# Altium schematic sheet Trans_V2.3.SchDoc
size A2
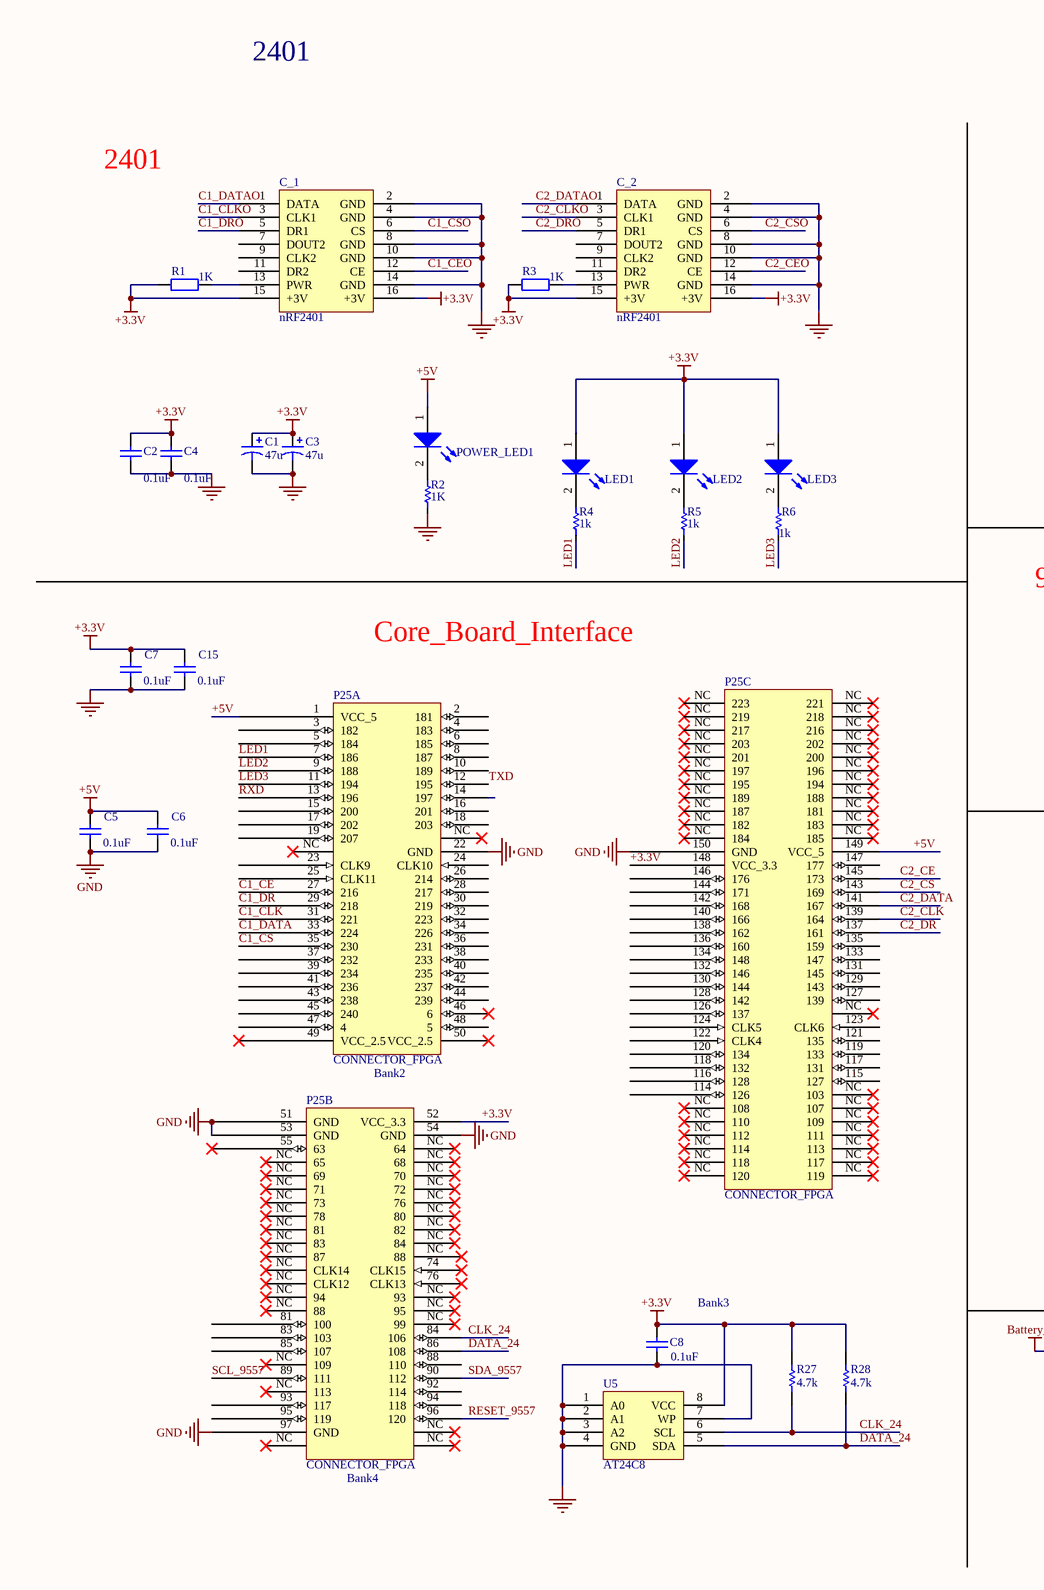
[diagram p0: Trans_V2.3.SchDoc, left]
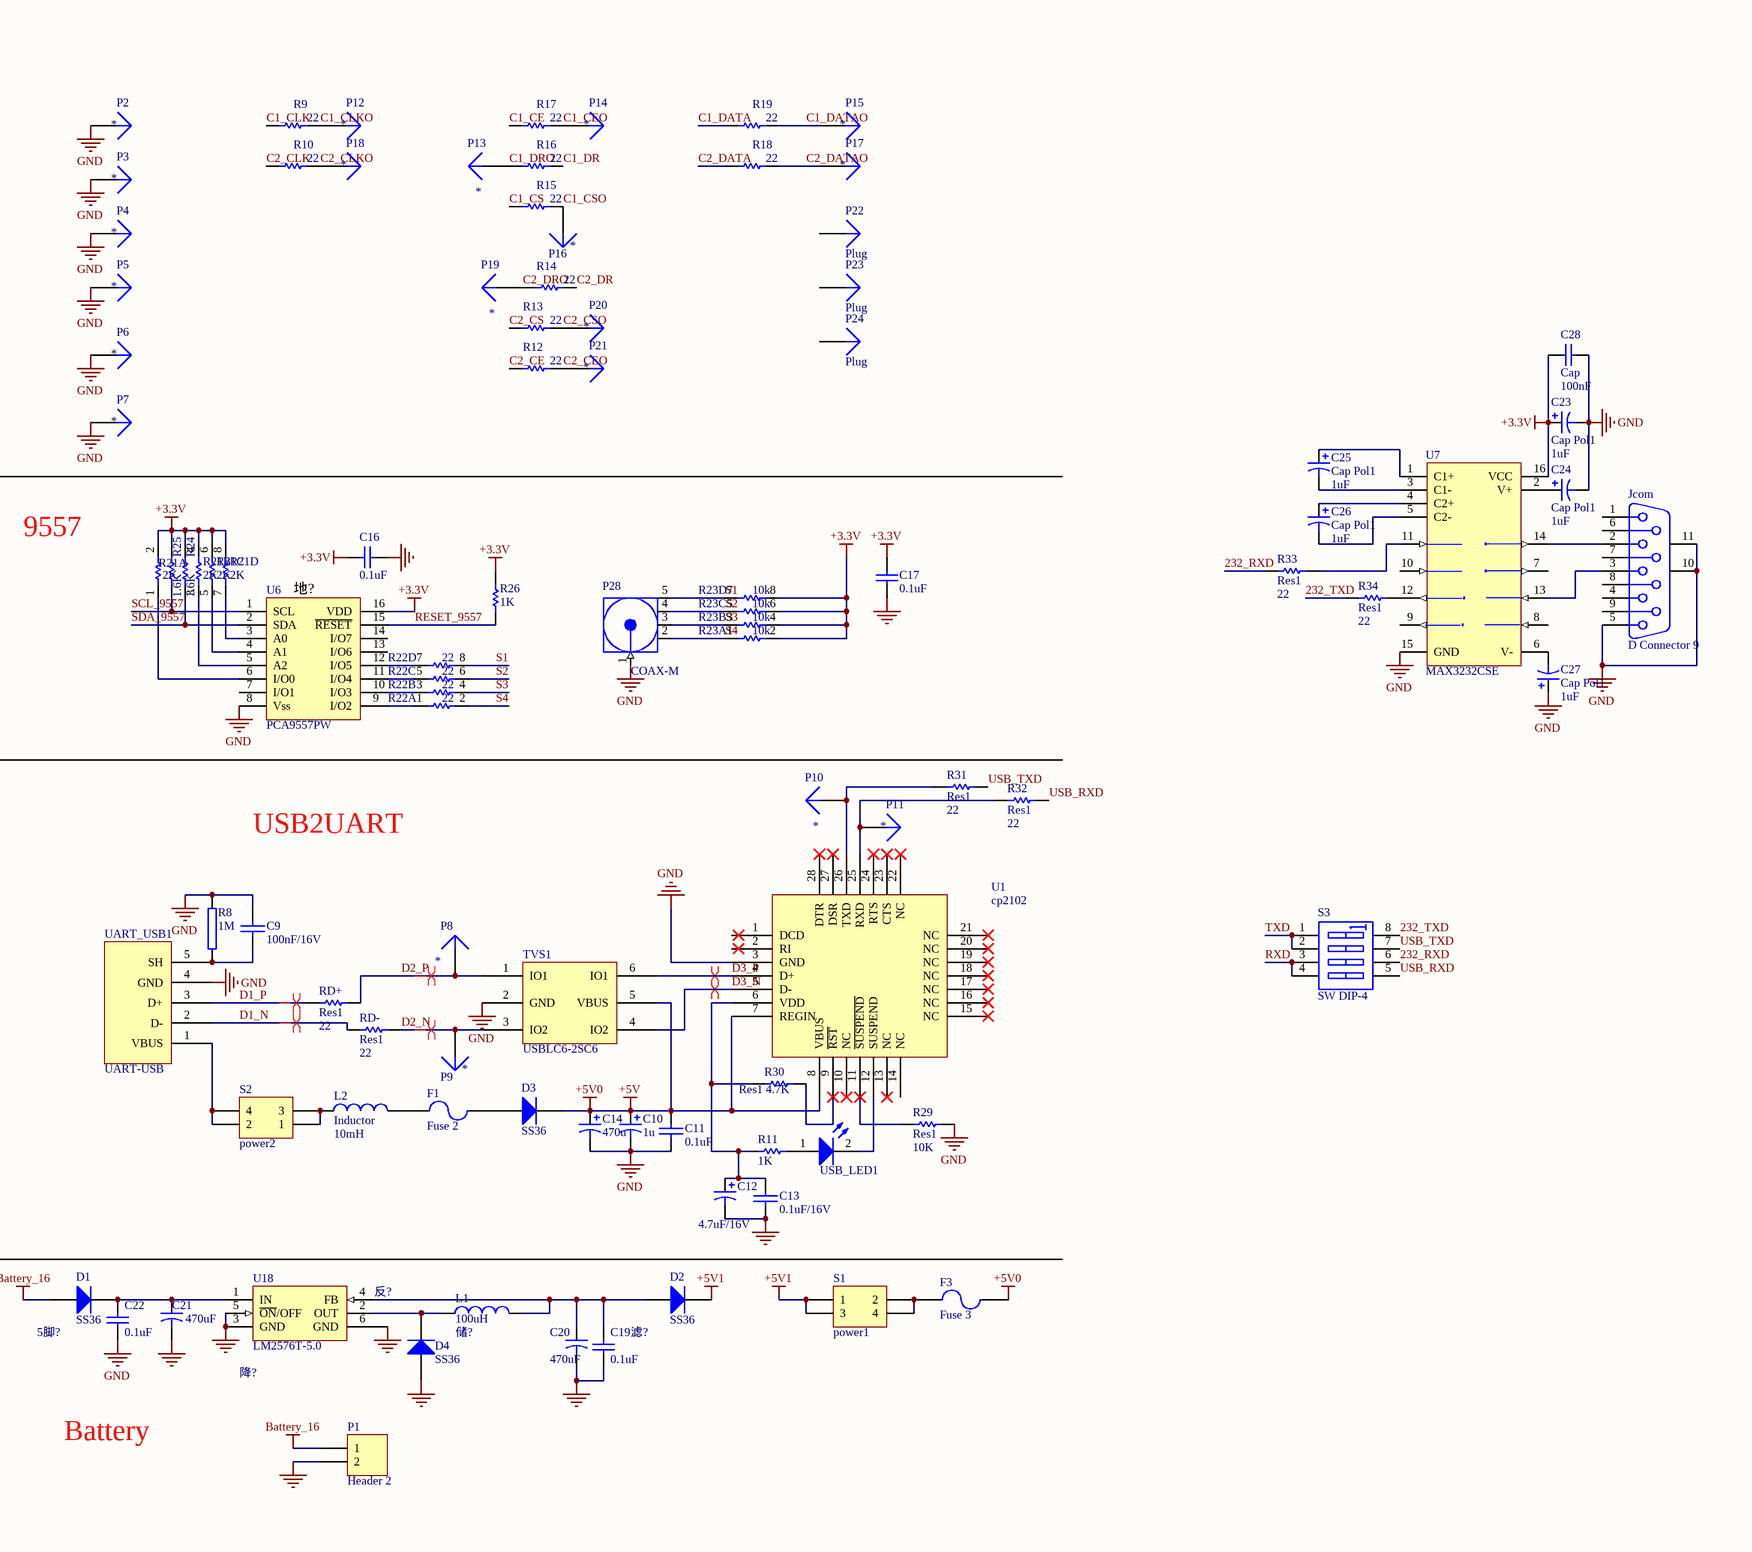
[diagram p1: Trans_V2.3.SchDoc, right]

## Parts
C1  47u  [7343c/d]
C2  0.1uF  [0805C]
C3  47u  [7343C/D]
C4  0.1uF  [0805C]
C5  0.1uF  [0805C]
C6  0.1uF  [0805C]
C7  0.1uF  [0805C]
C8  0.1uF  [0805C]
C9  100nF/16V  [0805C]
C10  1u  [CAP-3216]
C11  0.1uF  [0805C]
C12  4.7uF/16V  [CAP-3216]
C13  0.1uF/16V  [0805C]
C14  470u  [J10]
C15  0.1uF  [0805C]
C16  0.1uF  [0805C]
C17  0.1uF  [0805C]
C19  0.1uF  [0805C]
C20  470uF  [J10]
C21  470uF  [J10]
C22  0.1uF  [0805C]
C23  Cap Pol1  value 1uF  [CAP-3216]
C24  Cap Pol1  value 1uF  [CAP-3216]
C25  Cap Pol1  value 1uF  [CAP-3216]
C26  Cap Pol1  value 1uF  [CAP-3216]
C27  Cap Pol1  value 1uF  [CAP-3216]
C28  Cap  value 100nF  [0805C]
C_1  nRF2401  [HDR2X8]
C_2  nRF2401  [HDR2X8]
D1  SS36  [SMC]
D2  SS36  [SMC]
D3  SS36  [SMC]
D4  SS36  [SMC]
F1  Fuse 2  [保险丝1206]
F3  Fuse 3  [保险丝1206]
Jcom  D Connector 9  [DSUB1.385-2H9]
L1  value 100uH  [L]  (hidden comment: Inductor)
L2  Inductor  value 10mH  [1206]
LED1  LED1  [0805D]  (value not drawn)
LED2  LED2  [0805D]  (value not drawn)
LED3  LED3  [0805D]  (value not drawn)
P1  Header 2  [DC3]
P2  *  [安装孔-3.5-5]
P3  *  [安装孔-3.5-5]
P4  *  [安装孔-3.5-5]
P5  *  [安装孔-3.5-5]
P6  *  [安装孔-3.5-5]
P7  *  [安装孔-3.5-5]
P8  *  [TestPoint]
P9  *  [TestPoint]
P10  *  [TestPoint]
P11  *  [TestPoint]
P12  *  [TestPoint]
P13  *  [TestPoint]
P14  *  [TestPoint]
P15  *  [TestPoint]
P16  *  [TestPoint]
P17  *  [TestPoint]
P18  *  [TestPoint]
P19  *  [TestPoint]
P20  *  [TestPoint]
P21  *  [TestPoint]
P22  Plug  [MARK]
P23  Plug  [MARK]
P24  Plug  [MARK]
P25  CONNECTOR_FPGA  [CONNECTOR_FPGA]  (parts A,B,C of 3)
P28  COAX-M  [A6RV-161RS]
POWER_LED1  LED2  [0805D]  (value not drawn)
R1  1k  [0805R]
R2  1K  [0805R]
R3  1K  [0805R]
R4  1K  [0805R]
R5  1k  [0805R]
R6  1k  [0805R]
R8  1M  [0805R]
R9  22  [0805R]
R10  22  [0805R]
R11  1K  [0805R]
R12  22  [0805R]
R13  22  [0805R]
R14  22  [0805R]
R15  22  [0805R]
R16  22  [0805R]
R17  22  [0805R]
R18  22  [0805R]
R19  22  [0805R]
R21  2K  [0603排阻]  (parts A,B,C,D of 4)
R22  22  [0603排阻]  (parts A,B,C,D of 4)
R23  10k  [0603排阻]  (parts A,B,C,D of 4)
R24  1.6K  [0805R]
R25  1.6K  [0805R]
R26  1K  [0805R]
R27  value 4.7k  [0805R]  (hidden comment: 10k)
R28  value 4.7k  [0805R]  (hidden comment: 10k)
R29  Res1  value 10K  [0805R]
R30  Res1  value 4.7K  [0805R]
R31  Res1  value 22  [0805R]
R32  Res1  value 22  [0805R]
R33  Res1  value 22  [0805R]
R34  Res1  value 22  [0805R]
RD+  Res1  value 22  [0805R]
RD-  Res1  value 22  [0805R]
S1  power1  [A8L-21-11N2]
S2  power2  [A8L-21-11N2]
S3  SW DIP-4  [SO8_M]
TVS1  USBLC6-2SC6  [SOT23-6_M]
U1  cp2102  [QFN50P500X500-28VAM]
U5  AT24C8  [SO-G8]
U6  PCA9557PW  [TSSOP16]
U7  MAX3232CSE  [NSO16_M]
U18  LM2576T-5.0  [D2PAK]
UART_USB1  UART-USB  [USB-B]
USB_LED1  LED2  [0805D]  (value not drawn)

## Nets
+3.3V: C1.1 C2.2 C3.1 C4.2 C7.2 C8.2 C15.2 C16.2 C17.2 C23.1 C28.2 C_1.15(+3V) C_1.16(+3V) C_2.15(+3V) C_2.16(+3V) LED1.1(A) LED2.1(A) LED3.1(A) P25.52(VCC_3.3) P25.148(VCC_3.3) R1.1 R3.1 R21.2 R21.4 R21.6 R21.8 R23.2 R23.4 R23.6 R23.8 R24.1 R25.1 R26.2 R27.2 R28.2 U5.8(VCC) U6.16(VDD) U7.16(VCC)
+5V: C5.2 C6.2 C10.1 C11.1 C14.1 D3.2(K) F3.2 P25.1(VCC_5) P25.149(VCC_5) POWER_LED1.1(A) TVS1.5(VBUS) U1.7(REGIN) U1.8(VBUS)  [also labelled +5V0]
+5V1: D2.2(K) S1.1 S1.3
Battery_16: D1.1(A) P1.1
GND: C1.2 C2.1 C3.2 C4.1 C5.1 C6.1 C7.1 C8.1 C9.1 C10.2 C11.2 C12.2 C13.2 C14.2 C15.1 C16.1 C17.1 C19.1 C20.2 C21.2 C22.1 C23.2 C24.2 C27.1 C28.1 C_1.2(GND) C_1.4(GND) C_1.8(GND) C_1.10(GND) C_1.14(GND) C_2.2(GND) C_2.4(GND) C_2.8(GND) C_2.10(GND) C_2.14(GND) D4.1(A) Jcom.5 Jcom.10(MH1) Jcom.11(MH2) P1.2 P2.1 P3.1 P4.1 P5.1 P6.1 P7.1 P25.22(GND) P25.51(GND) P25.53(GND) P25.54(GND) P25.97(GND) P25.150(GND) P28.1(Signal) R2.2 R8.1 R29.2 TVS1.2(GND) U1.3(GND) U5.1(A0) U5.2(A1) U5.3(A2) U5.4(GND) U5.7(WP) U6.8(Vss) U7.15(GND) U18.3(GND) U18.5(~{ON}/OFF) U18.6(GND) UART_USB1.4(GND)
232_RXD: R33.1 S3.6(B3)
232_TXD: R34.1 S3.8(B1)
C1_CE: P25.27(216) R17.2
C1_CEO: C_1.12(CE) P14.1 R17.1
C1_CLK: P25.31(221) R9.2
C1_CLKO: C_1.3(CLK1) P12.1 R9.1
C1_CS: P25.35(230) R15.2
C1_CSO: C_1.6(CS) P16.1 R15.1
C1_DATA: P25.33(224) R19.2
C1_DATAO: C_1.1(DATA) P15.1 R19.1
C1_DR: P25.29(218) R16.1
C1_DRO: C_1.5(DR1) P13.1 R16.2
C2_CE: P25.145(173) R12.2
C2_CEO: C_2.12(CE) P21.1 R12.1
C2_CLK: P25.139(164) R10.2
C2_CLKO: C_2.3(CLK1) P18.1 R10.1
C2_CS: P25.143(169) R13.2
C2_CSO: C_2.6(CS) P20.1 R13.1
C2_DATA: P25.141(167) R18.2
C2_DATAO: C_2.1(DATA) P17.1 R18.1
C2_DR: P25.137(161) R14.1
C2_DRO: C_2.5(DR1) P19.1 R14.2
CLK_24: P25.84(106) R27.1 U5.6(SCL)
D1_N: RD-.1 UART_USB1.2(D-)
D1_P: RD+.1 UART_USB1.3(D+)
D2_N: P9.1 RD-.2 TVS1.3(IO2)
D2_P: P8.1 RD+.2 TVS1.1(IO1)
D3_N: TVS1.4(IO2) U1.5(D-)
D3_P: TVS1.6(IO1) U1.4(D+)
DATA_24: P25.86(108) R28.1 U5.5(SDA)
LED1: P25.7(186) R4.2
LED2: P25.9(188) R5.2
LED3: P25.11(194) R6.2
RESET_9557: P25.96(120) R26.1 U6.15(~{RESET})
RXD: P25.13(196) S3.3(A3) S3.4(A4)
S1: P28.5(GND) R22.8 R23.7
S2: P28.4(GND) R22.6 R23.5
S3: P28.3(GND) R22.4 R23.3
S4: P28.2(GND) R22.2 R23.1
SCL_9557: P25.89(111) R25.2 U6.1(SCL)
SDA_9557: P25.90(112) R24.2 U6.2(SDA)
TXD: P25.12(195) S3.1(A1) S3.2(A2)
USB_RXD: R32.2 S3.5(B4)
USB_TXD: R31.2 S3.7(B2)
NetC9_2: C9.2 R8.2 UART_USB1.5(SH)
NetC12_1: C12.1 C13.1 R11.1 R30.1 U1.6(VDD)
NetC19_2: C19.2 C20.1 D2.1(A) L1.2 U18.4(FB)
NetC21_1: C21.1 C22.2 D1.2(K) U18.1(IN)
NetC24_1: C24.1 U7.2(V+)
NetC25_1: C25.1 U7.1(C1+)
NetC25_2: C25.2 U7.3(C1-)
NetC26_1: C26.1 U7.4(C2+)
NetC26_2: C26.2 U7.5(C2-)
NetC27_2: C27.2 U7.6(V-)
NetC_1_13: C_1.13(PWR) R1.2
NetC_2_13: C_2.13(PWR) R3.2
NetD3_1: D3.1(A) F1.2
NetD4_2: D4.2(K) L1.1 U18.2(OUT)
NetF1_1: F1.1 L2.2
NetF3_1: F3.1 S1.2 S1.4
NetJcom_2: Jcom.2 U7.14(T1OUT)
NetJcom_3: Jcom.3 U7.13(R1IN)
NetL2_1: L2.1 S2.1 S2.3
NetLED1_2: LED1.2(K) R4.1
NetLED2_2: LED2.2(K) R5.1
NetLED3_2: LED3.2(K) R6.1
NetP10_1: P10.1 R31.1 U1.26(TXD)
NetP11_1: P11.1 R32.1 U1.25(RXD)
NetPOWER_LED1_2: POWER_LED1.2(K) R2.1
NetR11_2: R11.2 USB_LED1.1(A)
NetR21_1: R21.1 U6.6(I/O0)
NetR21_3: R21.3 U6.5(A2)
NetR21_5: R21.5 U6.4(A1)
NetR21_7: R21.7 U6.3(A0)
NetR22_1: R22.1 U6.9(I/O2)
NetR22_3: R22.3 U6.10(I/O3)
NetR22_5: R22.5 U6.11(I/O4)
NetR22_7: R22.7 U6.12(I/O5)
NetR29_1: R29.1 U1.11(~{SUSPEND})
NetR30_2: R30.2 U1.9(~{RST})
NetR33_2: R33.2 U7.11(T1IN)
NetR34_2: R34.2 U7.12(R1OUT)
NetS2_2: S2.2 S2.4 UART_USB1.1(VBUS)
NetU1_12: U1.12(SUSPEND) USB_LED1.2(K)

Not connected (* = marked no-connect by the designer): C_1 7(DOUT2) 9(CLK2) 11(DR2); C_2 7(DOUT2) 9(CLK2) 11(DR2); Jcom 1 4 6 7 8 9; P22 1; P23 1; P24 1; P25 2(181) 3(182) 4(183) 5(184) 6(185) 8(187) 10(189) 14(197) 15(200) 16(201) 17(202) 18(203) 19(207) 23(CLK9) 24(CLK10) 25(CLK11) 26(214) 28(217) 30(219) 32(223) 34(226) 36(231) 37(232) 38(233) 39(234) 40(235) 41(236) 42(237) 43(238) 44(239) 45(240) 46(6)* 47(4) 48(5) 49(VCC_2.5)* 50(VCC_2.5)* 55(63)* 74(CLK15)* 76(CLK13)* 81(100) 83(103) 85(107) 88(110) 92(114) 93(117) 94(118) 95(119) 114(126) 115(127) 116(128) 117(131) 118(132) 119(133) 120(134) 121(135) 122(CLK4) 123(CLK6) 124(CLK5) 126(137) 127(139) 128(142) 129(143) 130(144) 131(145) 132(146) 133(147) 134(148) 135(159) 136(160) 138(162) 140(166) 142(168) 144(171) 146(176) 147(177) NC*; U1 1(DCD) 2(RI) 10(NC)* 13(NC)* 14(NC) 15(NC)* 16(NC)* 17(NC)* 18(NC)* 19(NC)* 20(NC)* 21(NC)* 22(NC)* 23(CTS)* 24(RTS)* 27(DSR)* 28(DTR)*; U6 7(I/O1) 13(I/O6) 14(I/O7); U7 7(T2OUT) 8(R2IN) 9(R2OUT) 10(T2IN)

## Layout directives
differential pair: D1_N, D1_P, D2_N, D2_P, D3_N, D3_P

## Notes on the sheet
- 2401
- 9557
- Core_Board_Interface
- (near U6) 地?
- USB2UART
- (near P25) Bank2
- (near C8) Bank3
- (near U18) 反?
- (near D1) 5脚?
- (near L1) 储?
- 滤?
- (near P25) Bank4
- (near U18) 降?
- Battery

## Library data of the parts
C1 C3 C10 C12 C14 C23-C27 = Cap Pol1: Polarized Capacitor (Radial); Published: 8-Jun-2000; LatestRevisionDate: 17-Jul-2002; LatestRevisionNote: Re-released for DXP Platform.; Publisher: Altium Limited
  C12: Value: 4.7uF/16V
  C23-C27: PackageReference: RB7.6-15; PackageDescription: Polarized Capacitor (Radial); 2 Leads
C2 C4-C8 C15-C17 C19 C22 C28 = Cap: Capacitor; Published: 8-Jun-2000; LatestRevisionDate: 17-Jul-2002; LatestRevisionNote: Re-released for DXP Platform.; Publisher: Altium Limited
  C2 C4-C8 C15-C17: Value: 0.1uF
  C28: PackageReference: RAD-0.3; PackageDescription: Radial Cap, Thru-Hole; 2 Leads; 0.3 in Pin Spacing
C9 = CAP: 无极性电容; Text Field2: 2KVDC-4.7nF; Text Field: CT4G-100V-220uF(高频); Text Field5: CBB12-0.47uF; Text Field6: TMK 316 F 474Z/TMK 316 F 105Z/TMK  316 F 475Z/TMK 325 106Z; Text Field7: EMK 316 F 105Z; Text Field8: LMK 325 F 106Z; 型?: *; 名?: *; 备?: *; 更?: *; 零?: *
C11 C13 = CAP: Capacitor
C20 C21 = Cap2: 25V 470uf 10*10; Published: 23-Sep-2002; Publisher: Altium Limited
C_1 C_2 = nRF2401: 2.4G, wireless
D1-D4 = Diode: Default Diode; Manufacturer: Generic Components; Class: Discrete; SubClass: Diode - Switching; Published: 08/06/2000; Publisher: Altium Hobart Technology Centre
F1 F3 = Fuse 2: Fuse; Published: 8-Jun-2000; LatestRevisionDate: 17-Jul-2002; LatestRevisionNote: Re-released for DXP Platform.; PackageReference: PIN-W2/E2.8; Publisher: Altium Limited
Jcom = D Connector 9: Receptacle Assembly, 9 Position, Right Angle; PackageDocument: O; Positions: 9; Published: 15-Jun-2001; LatestRevisionDate: 17-Jul-2002; LatestRevisionNote: Re-released for DXP Platform.; DatasheetDocument: 1-Sep-1999; PackageReference: 788750; Publisher: Altium Limited; Orientation: Right Angle; Gender: Receptacle
L1 = Inductor: Manufacturer: Generic Components; Class: Passive; Published: 08/06/2000; Publisher: Altium Hobart Technology Centre; SubClass: Inductor
L2 = Inductor: Code_IEC: 1005; Published: 8-Jun-2000; LatestRevisionDate: 29-May-2009; LatestRevisionNote: IPC-7351 Footprint Added.; PackageReference: 0402-A; Publisher: Altium Limited; PackageDescription: Chip Inductor; Code_JEITA: 0402
LED1-LED3 POWER_LED1 USB_LED1 = LED2: Typical RED, GREEN, YELLOW, AMBER GaAs LED; Manufacturer: Generic Components; Class: Optoelectronic; Published: 08/06/2000; Publisher: Altium Hobart Technology Centre; SubClass: LED
P1 = Header 2: Header, 2-Pin; LatestRevisionDate: 17-Jul-2002; LatestRevisionNote: Re-released for DXP Platform.; Publisher: Altium Limited
P2-P21 = Plug: LatestRevisionDate: 17-Jul-2002; LatestRevisionNote: Re-released for DXP Platform.; Publisher: Altium Limited
P25 = CONNECTOR_
P28 = COAX-M: RF Coaxial PCB Connector, MMCX; Thru-Hole, Vertical Mount Plug,  50 Ohm Impedance; PackageDocument: Rev. A, 16-Jun-1997; PCB_Layout: Complies with manufacturer's recommendation.; DrillSize: Corresponds to nominal value.; Published: 15-Jul-2004; LatestRevisionDate: 15-Jul-2004; LatestRevisionNote: Component Replaced.; DatasheetDocument: 30-May-2003; PackageReference: 908-21103; Publisher: Altium Limited; ComponentLink1Description: Manufacturer Link; ComponentLink1URL: http://www.amphenolrf.com/
R1 R3 = Res2: Resistor; Published: 8-Jun-2000; LatestRevisionDate: 17-Jul-2002; LatestRevisionNote: Re-released for DXP Platform.; PackageReference: AXIAL-0.4; Publisher: Altium Limited; Value: 1K
R2 R4-R6 R11 R24-R26 = Res1: Resistor; Manufacturer: Generic Components; Class: Passive; Published: 08/06/2000; Publisher: Altium Hobart Technology Centre; SubClass: Resistor
  R2 R11 R26: Value: 1K
  R4-R6: Value: 1k
  R24 R25: Value: 1.6K
R8 = RE: 电阻器; Text Field2: RJ14-1k; 型号: *; 名称: *; 备注: *; 更改: *; 零?: *; 电流: *; 电压: *; 功率: *
R9 R10 R12-R19 R27 R28 = SR0805: Resistance
  R9 R10 R12-R19: VALUE: 22
R21-R23 = 080
R29-R34 RD+ RD- = Res1: Resistor; Published: 8-Jun-2000; LatestRevisionDate: 17-Jul-2002; LatestRevisionNote: Re-released for DXP Platform.; PackageReference: AXIAL-0.3; Publisher: Altium Limited; PackageDescription: Axial Device, Thru-Hole; 2 Leads; 0.3 in Pin Spacing
S1 S2 = Header 2X2: Header, 2-Pin, Dual row; LatestRevisionDate: 17-Jul-2002; LatestRevisionNote: Re-released for DXP Platform.; Publisher: Altium Limited
S3 = SW DIP-4: DIP Switch, 4 Position, SPST; Published: 24-Mar-1999; LatestRevisionDate: 29-May-2009; LatestRevisionNote: IPC-7351 Footprint Added.; PackageVersion: Dec-2002; PackageReference: SO8; Publisher: Altium Limited; PackageDescription: 8-Pin Small Outline Integrated Circuit 1.27 mm Pitch; Code_JEDEC: MS-012-AA; Code_IPC: SOIC127P600-8
U7 = MAX3232CSE: 3.0V TO 5.5V, Low-Power, up to 1Mbps, True RS-232 Transceiver Using Four 0.1礔 External Capacitor; Published: 16-Jan-2001; LatestRevisionDate: 13-Apr-2006; LatestRevisionNote: IPC-7351 Footprint Added.; DatasheetVersion: Mar-1999; PackageReference: NSO16; Publisher: Altium Limited; PackageDescription: 16-Pin Small Outline Integrated Circuit 1.27 mm Pitch; Code_JEDEC: MS-012-AC; Code_IPC: SOIC127P600-16; ComponentLink1Description: Manufacturer Link; ComponentLink1URL: http://www.maxim-ic.com/; ComponentLink2Description: Datasheet; ComponentLink2URL: http://pdfserv.maxim-ic.com/en/ds/MAX3222-MAX3241.pdf
U18 = LM2575T-5.0: Simple Switcher 1A Step Down Voltage Regulator; Manufacturer: National Semiconductor; Class: Power Management; SubClass: Switching Regulator; Note: Tab is connected to GND; Published: 15/04/2002; Publisher: Altium Hobart Technology Centre
P22-P24 = Plug: LatestRevisionDate: 17-Jul-2002; LatestRevisionNote: Re-released for DXP Platform.; Publisher: Altium Limited